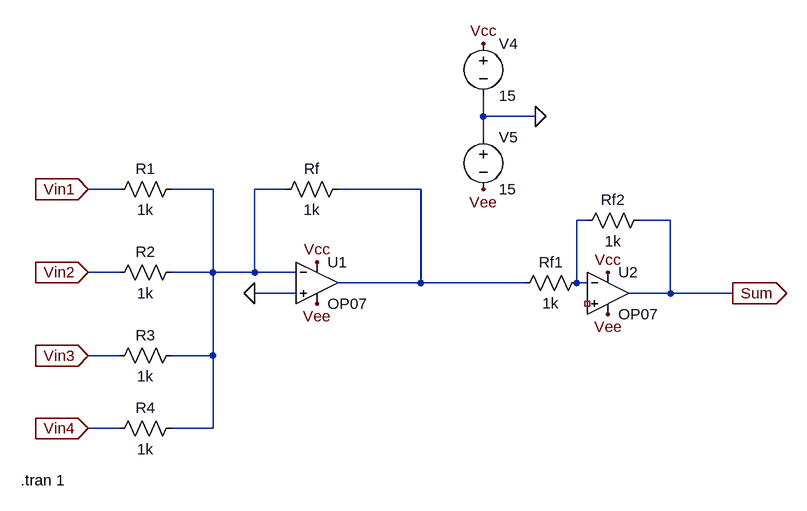
[diagram p0: schematic adder.asc]
adder.asc, the LTspice schematic file:
Version 4
SHEET 1 1200 680
WIRE 704 -80 704 -112
WIRE 784 -80 704 -80
WIRE 704 -48 704 -80
WIRE 144 32 96 32
WIRE 288 32 224 32
WIRE 400 32 352 32
WIRE 608 32 480 32
WIRE 864 80 848 80
WIRE 992 80 944 80
WIRE 144 160 96 160
WIRE 288 160 288 32
WIRE 288 160 224 160
WIRE 352 160 352 32
WIRE 352 160 288 160
WIRE 416 160 352 160
WIRE 608 176 608 32
WIRE 608 176 480 176
WIRE 768 176 608 176
WIRE 848 176 848 80
WIRE 864 176 848 176
WIRE 416 192 352 192
WIRE 992 192 992 80
WIRE 992 192 928 192
WIRE 1088 192 992 192
WIRE 144 288 96 288
WIRE 288 288 288 160
WIRE 288 288 224 288
WIRE 144 400 96 400
WIRE 288 400 288 288
WIRE 288 400 224 400
FLAG 352 192 0
FLAG 784 -80 0
FLAG 704 -192 Vcc
FLAG 448 144 Vcc
FLAG 704 32 Vee
FLAG 448 208 Vee
FLAG 896 224 Vee
FLAG 896 160 Vcc
FLAG 96 32 Vin1
IOPIN 96 32 In
FLAG 96 160 Vin2
IOPIN 96 160 In
FLAG 96 288 Vin3
IOPIN 96 288 In
FLAG 96 400 Vin4
IOPIN 96 400 In
FLAG 1088 192 Sum
IOPIN 1088 192 Out
SYMBOL res 240 16 R90
WINDOW 0 0 56 VBottom 2
WINDOW 3 32 56 VTop 2
SYMATTR InstName R1
SYMATTR Value 1k
SYMBOL res 240 144 R90
WINDOW 0 0 56 VBottom 2
WINDOW 3 32 56 VTop 2
SYMATTR InstName R2
SYMATTR Value 1k
SYMBOL res 240 272 R90
WINDOW 0 0 56 VBottom 2
WINDOW 3 32 56 VTop 2
SYMATTR InstName R3
SYMATTR Value 1k
SYMBOL OpAmps\\OP07 448 112 R0
SYMATTR InstName U1
SYMBOL res 496 16 R90
WINDOW 0 0 56 VBottom 2
WINDOW 3 32 56 VTop 2
SYMATTR InstName Rf
SYMATTR Value 1k
SYMBOL voltage 704 -208 R0
WINDOW 123 0 0 Left 0
WINDOW 39 0 0 Left 0
SYMATTR InstName V4
SYMATTR Value 15
SYMBOL voltage 704 -64 R0
WINDOW 123 0 0 Left 0
WINDOW 39 0 0 Left 0
SYMATTR InstName V5
SYMATTR Value 15
SYMBOL OpAmps\\OP07 896 128 R0
SYMATTR InstName U2
SYMBOL res 864 160 R90
WINDOW 0 0 56 VBottom 2
WINDOW 3 32 56 VTop 2
SYMATTR InstName Rf1
SYMATTR Value 1k
SYMBOL res 960 64 R90
WINDOW 0 0 56 VBottom 2
WINDOW 3 32 56 VTop 2
SYMATTR InstName Rf2
SYMATTR Value 1k
SYMBOL res 240 384 R90
WINDOW 0 0 56 VBottom 2
WINDOW 3 32 56 VTop 2
SYMATTR InstName R4
SYMATTR Value 1k
TEXT -8 480 Left 2 !.tran 1

The netlist it stands for:
* adder.asc
R1 N001 Vin1 1k
R2 N001 Vin2 1k
R3 N001 Vin3 1k
XU1 0 N001 Vcc Vee N002 LT1001  ; OP07, pins In+ In- V+ V- OUT
Rf N002 N001 1k
V4 Vcc 0 15
V5 0 Vee 15
XU2 NC_01 N003 Vcc Vee Sum LT1001  ; OP07, pins In+ In- V+ V- OUT
Rf1 N003 N002 1k
Rf2 Sum N003 1k
R4 N001 Vin4 1k
.tran 1
.lib LTC.lib
.backanno
.end